# EAGLE design uc-com (EAGLE 9.6.2)
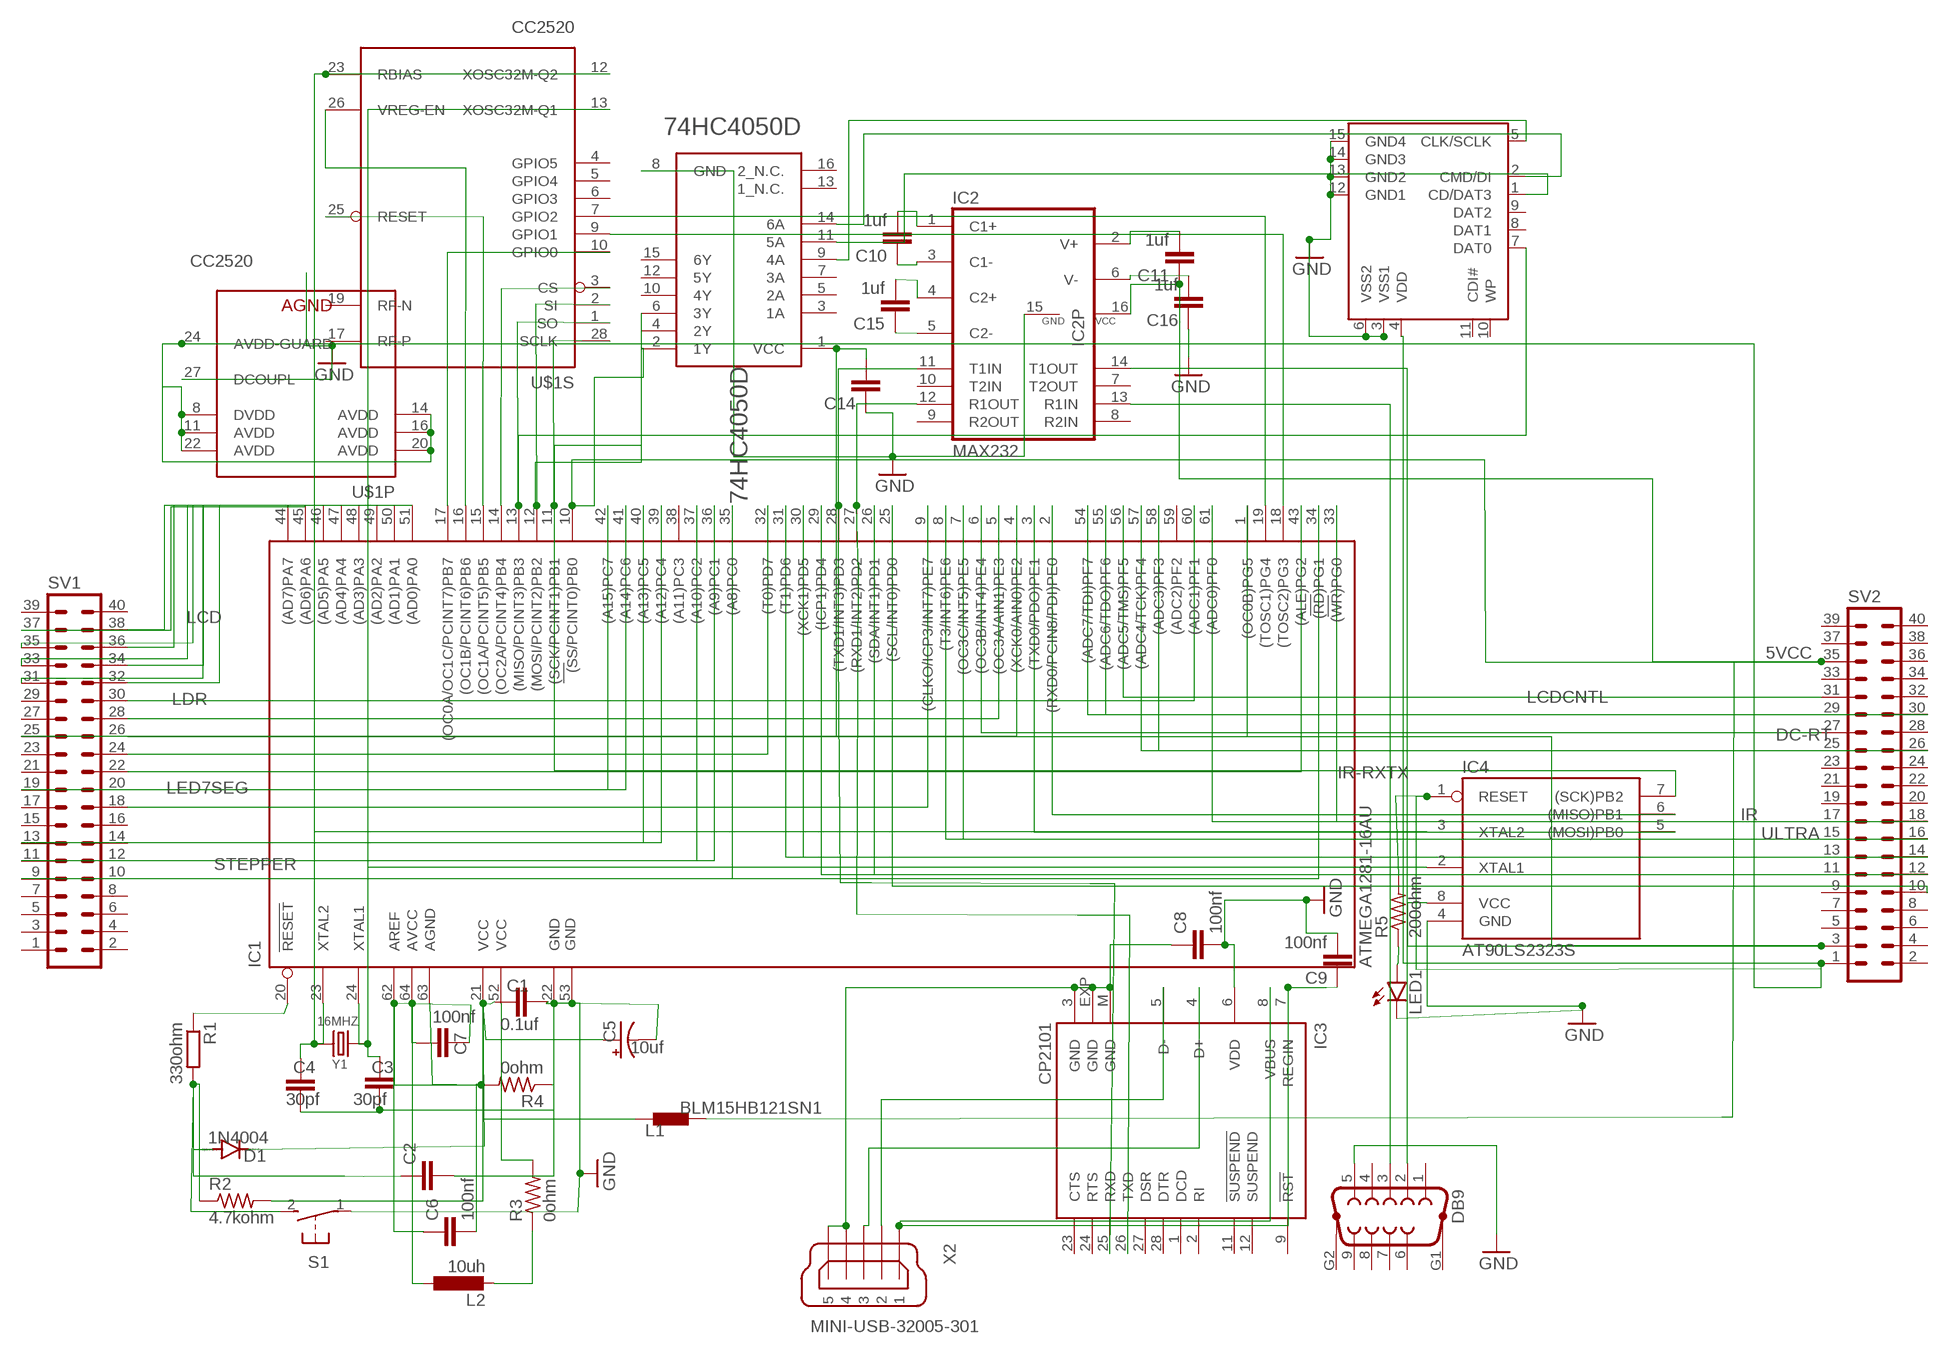
[diagram p0: schematic, sheet 1]

## Parts
74HC4050D  NXP_74HC4050DNXP_74HC4050D_0_0  [NXP_74HC4050D_0]
C1  0.1uf  C-EUC0201  [C0201]
C2  C-EUC0402  [C0402]
C3  30pf  C-EUC0201  [C0201]
C4  30pf  C-EUC0201  [C0201]
C5  10uf  CPOL-US085CS-1AR  [085CS_1AR]
C6  100nf  C-EUC0402K  [C0402K]
C7  100nf  C-EUC0402K  [C0402K]
C8  100nf  C-EUC0402K  [C0402K]
C9  100nf  C-EUC0402K  [C0402K]
C10  1uf  C-EUC0402K  [C0402K]
C11  1uf  C-EUC0402K  [C0402K]
C14  C-EUC0402K  [C0402K]
C15  1uf  C-EUC0402K  [C0402K]
C16  1uf  C-EUC0402K  [C0402K]
D1  1N4004  [DO41-10]
DB9  F09HP-7.2  [F09HP-7.2]
IC1  ATMEGA1281-16AU  [TQFP64]
IC2  MAX232  [DIL16]
IC3  CP2101  [MLP28]
IC4  AT90LS2323S  [SO08]
L1  BLM15HB121SN1  [0402]
L2  10uh  L-EU0204/7  [0204/7]
LED1  LED5MM  [LED5MM]
R1  330ohm  R-EU_R0603  [R0603]
R2  4.7kohm  R-US_M0805  [M0805]
R3  0ohm  R-US_M0805  [M0805]
R4  0ohm  R-US_M0805  [M0805]
R5  200ohm  R-US_M0805  [M0805]
S1  31-XX  [B3F-31XX]
SDCARD  SDCARDVAR2  [SDCMF-10915W010]
SV1  40P  [40P]
SV2  40P  [40P]
U$1  CC2520  [QFN50P500X500X100-29N]
X2  MINI-USB-32005-301  [32005-301]
Y1  16MHZ  DIP-CRYSTAL-16MHZ-18PF-30PPM-40R(HC49US)  [HC49US]

## Nets
5VCC: 74HC4050D.2(1Y) C11.1 IC1.10((SS/PCINT0)PB0) IC2.16(VCC) L1.1 SV2.35
7SEG: IC1.41((A14)PC6) SV1.19
DC-RT: IC1.6((OC3B/INT4)PE4) SV2.27
DH: IC1.32((T0)PD7) SV1.24
GND: 74HC4050D.8(GND) C1.2 C2.2 C3.2 C4.2 C5.- C8.2 C9.2 C14.1 C16.1 DB9.5 IC1.22(GND) IC1.53(GND1) IC2.15(GND) IC3.6(VDD) IC4.4(GND) LED1.K(C) R4.1 S1.1(P) SDCARD.3(VSS1) SDCARD.6(VSS2) SDCARD.12(GND1) SDCARD.13(GND2) SDCARD.14(GND3) SDCARD.15(GND4) U$1.27(P:DCOUPL) U$1.29(P:AGND)
IR: IC1.61((ADC0)PF0) SV2.17
IR-RXTX: IC1.33((WR)PG0) SV2.18
LCD: IC1.45((AD6)PA6) SV1.37
LCDCNTL: IC1.56((ADC5/TMS)PF5) SV2.31
LDR: IC1.60((ADC1)PF1) SV1.30
LED7SEG: IC1.43((ALE)PG2) SV1.22
N$1: C2.1 D1.A R1.2 R2.1 S1.2(S)
N$2: IC1.20(RESET) R1.1
N$3: C1.1 C5.+ D1.C IC1.21(VCC) L1.2 R2.2
N$4: 74HC4050D.1(VCC) C14.2 IC4.8(VCC) SV2.3
N$5: C4.1 IC1.23(XTAL2) IC4.3(XTAL2) U$1.12(S:XOSC32M-Q2) U$1.23(S:RBIAS) Y1.2
N$6: C7.2 IC1.64(AVCC) L2.1
N$7: C3.1 IC1.24(XTAL1) IC4.2(XTAL1) U$1.13(S:XOSC32M-Q1) Y1.1
N$8: C6.1 C6.2 C7.1 IC1.62(AREF) IC1.63(AGND) R4.2
N$9: IC1.27((RXD1/INT2)PD2) IC2.12(R1OUT) IC3.26(TXD)
N$10: L2.2 R3.1
N$11: IC1.52(VCC1) R3.2
N$12: IC1.28((TXD1/INT3)PD3) IC2.11(T1IN) IC3.25(RXD)
N$13: IC1.44((AD7)PA7) SV1.38
N$14: IC4.1(RESET) R5.2 SDCARD.4(VDD) SV2.1 U$1.8(P:DVDD) U$1.11(P:AVDD) U$1.14(P:AVDD) U$1.16(P:AVDD) U$1.20(P:AVDD) U$1.22(P:AVDD) U$1.24(P:AVDD-GUARD)
N$15: IC1.46((AD5)PA5) SV1.36
N$16: IC1.47((AD4)PA4) SV1.35
N$17: IC1.48((AD3)PA3) SV1.34
N$18: IC1.49((AD2)PA2) SV1.33
N$19: IC1.50((AD1)PA1) SV1.32
N$20: IC1.51((AD0)PA0) SV1.31
N$21: IC1.15((OC1A/PCINT5)PB5) U$1.25(S:RESET)
N$22: IC1.16((OC1B/PCINT6)PB6) U$1.26(S:VREG-EN)
N$23: 74HC4050D.6(3Y) IC1.12((MOSI/PCINT2)PB2) U$1.2(S:SI)
N$24: IC1.13((MISO/PCINT3)PB3) SDCARD.7(DAT0) U$1.1(S:SO)
N$25: 74HC4050D.4(2Y) IC1.11((SCK/PCINT1)PB1) IC4.7((SCK)PB2) U$1.28(S:SCLK)
N$26: IC1.14((OC2A/PCINT4)PB4) U$1.3(S:CS)
N$27: IC1.17((OC0A/OC1C/PCINT7)PB7) U$1.10(S:GPIO0)
N$28: IC1.18((TOSC2)PG3) U$1.9(S:GPIO1)
N$29: IC1.19((TOSC1)PG4) U$1.7(S:GPIO2)
N$30: IC3.5(D-) X2.2
N$31: IC3.4(D+) X2.3
N$32: C9.1 IC3.7(REGIN) IC3.8(VBUS) X2.1
N$33: C8.1 IC3.3(GND) IC3.EXP(GND) IC3.M(GND) X2.4 X2.5
N$34: DB9.3 IC2.13(R1IN)
N$35: DB9.2 IC2.14(T1OUT)
N$36: C15.1 IC2.5(C2-)
N$37: C15.2 IC2.4(C2+)
N$38: C11.2 IC2.2(V+)
N$39: C10.1 IC2.3(C1-)
N$40: C16.2 IC2.6(V-)
N$41: C10.2 IC2.1(C1+)
N$42: 74HC4050D.14(6A) SDCARD.2(CMD/DI)
N$43: IC1.54((ADC7/TDI)PF7) SV2.29
N$44: 74HC4050D.9(4A) SDCARD.5(CLK/SCLK)
N$45: 74HC4050D.11(5A) SDCARD.1(CD/DAT3)
N$47: IC1.55((ADC6/TDO)PF6) SV2.30
N$48: LED1.A R5.1
N$49: IC1.42((A15)PC7) SV1.20
N$50: IC1.58((ADC3)PF3) SV2.25
N$51: IC1.57((ADC4/TCK)PF4) SV2.26
N$52: IC1.1((OC0B)PG5) SV1.26
N$53: IC1.4((XCK0/AIN0)PE2) SV1.25
N$54: IC1.5((OC3A/AIN1)PE3) SV1.28
N$55: IC1.7((OC3C/INT5)PE5) SV2.15
N$56: IC1.25((SCL/INT0)PD0) SV2.10
N$57: IC1.26((SDA/INT1)PD1) SV2.11
N$58: IC1.29((ICP1)PD4) SV2.12
N$59: IC1.30((XCK1)PD5) SV2.13
N$60: IC1.31((T1)PD6) SV2.14
N$61: IC1.35((A8)PC0) SV1.10
N$62: IC1.39((A12)PC4) SV1.14
N$63: IC1.36((A9)PC1) SV1.12
N$64: IC1.37((A10)PC2) SV1.11
N$65: IC1.40((A13)PC5) SV1.13
N$66: IC1.9((CLKO/ICP3/INT7)PE7) SV1.18
N$67: IC1.2((RXD0/PCIN8/PDI)PE0) IC4.6((MISO)PB1)
N$68: IC1.3((TXD0/PDO)PE1) IC4.5((MOSI)PB0)
STEPPER: IC1.34((RD)PG1) SV1.9
ULTRA: IC1.8((T3/INT6)PE6) SV2.16
Unconnected: 74HC4050D.3(1A) 74HC4050D.5(2A) 74HC4050D.7(3A) 74HC4050D.10(4Y) 74HC4050D.12(5Y) 74HC4050D.13(1_N.C.) 74HC4050D.15(6Y) 74HC4050D.16(2_N.C.) DB9.1 DB9.4 DB9.6 DB9.7 DB9.8 DB9.9 DB9.G1 DB9.G2 IC1.38((A11)PC3) IC1.59((ADC2)PF2) IC2.7(T2OUT) IC2.8(R2IN) IC2.9(R2OUT) IC2.10(T2IN) IC3.1(DCD) IC3.2(RI) IC3.9(!RST) IC3.11(!SUSPEND) IC3.12(SUSPEND) IC3.23(CTS) IC3.24(RTS) IC3.27(DSR) IC3.28(DTR) SDCARD.8(DAT1) SDCARD.9(DAT2) SDCARD.10(WP) SDCARD.11(CDI#) SV1.1 SV1.2 SV1.3 SV1.4 SV1.5 SV1.6 SV1.7 SV1.8 SV1.15 SV1.16 SV1.17 SV1.21 SV1.23 SV1.27 SV1.29 SV1.39 SV1.40 SV2.2 SV2.4 SV2.5 SV2.6 SV2.7 SV2.8 SV2.9 SV2.19 SV2.20 SV2.21 SV2.22 SV2.23 SV2.24 SV2.28 SV2.32 SV2.33 SV2.34 SV2.36 SV2.37 SV2.38 SV2.39 SV2.40 U$1.4(S:GPIO5) U$1.5(S:GPIO4) U$1.6(S:GPIO3) U$1.15(NC) U$1.17(S:RF-P) U$1.18(NC) U$1.19(S:RF-N) U$1.21(NC)

## Library data of the parts
74HC4050D = NXP - 74HC4050D:NXP_74HC4050D: Buffer, Non-Inverting 6 Element 1 Bit per Element Push-Pull Output; CENTROID_NOT_SPECIFIED: No; DATASHEET: http://www.nxp.com/documents/data_sheet/74HC4050.pdf; DIGIKEY_DESCRIPTION: IC Buffer, Non-Inverting 6 Element 1 Bit per Element Push-Pull Output 16-SO; DIGIKEY_PART_NUMBER: 568-8150-1-ND; LEAD_FREE: yes; LOGIC_TYPE: Buffer, Non-Inverting; MF: NXP; MFG_PACKAGE_IDENT: SOT109-1; MOUSER_PART_NUMBER: 771-74HC4050D-T; MPN: 74HC4050D; NUMBER_OF_ELEMENTS: 6; PACKAGE: SOIC-16; PREFIX: U; ROHS: yes; TEMPERATURE_RANGE_HIGH: +125°C; TEMPERATURE_RANGE_LOW: -40°C; VOLTAGE_-_SUPPLY: 2V ~ 6V
C1-C4 C6-C11 C14-C16 = rcl:C-EU: CAPACITOR, European symbol; SPICEPREFIX: C
C5 = rcl:CPOL-US: POLARIZED CAPACITOR, American symbol; SPICEPREFIX: C
D1 = diode:1N4004: DIODE general purpose rectifier, 1 A
DB9 = sub-d:F09HP: SUB-D
IC1 = atmel-2005:ATMEGA1281*: MICROCONTROLLER 128 Kbytes FLASH 4 Kbytes EEPROM 8 Kbytes SRAM 54 General Purpose I/O pins 6-channels 16-bit PWM 2 x Serial USARTs 8-channels 10-bit A/D
IC2 = maxim:MAX232: RS232 TRANSCEIVER; MF: MAXIM; MPN: MAX232ACPE+; OC_FARNELL: 9723773; OC_NEWARK: 68K4544
IC3 = silabs:CP210*: Single-Chip USB to UART Bridge Source: www.silabs.com .. CP2101.pdf / cp2102.pdf; MF: FARNELL; MPN: CP2102-GM; OC_FARNELL: 9282130; OC_NEWARK: 30K5635
IC4 = atmel-1:AT90*2323: MICROCONTROLLER 2 Kbytes FLASH 128 bytes SRAM 128 bytes EEPROM
L1 = inductors:BLM15H: EMIFIL (R) Chip Ferrite Bead for GHz Noise Source: http://www.murata.com/ Ferrite Bead BLM15H.pdf
L2 = rcl:L-EU: INDUCTOR, European symbol; SPICEPREFIX: L
LED1 = led:LED: LED OSRAM: - CHIPLED LG R971, LG N971, LY N971, LG Q971, LY Q971, LO R971, LY R971 LH N974, LH R974 LS Q976, LO Q976, LY Q976 LO Q996 - Hyper CHIPLED LW Q18S LB Q993, LB Q99A, LB R99A - SideLED LS A670, LO A670, LY A670, LG A670, LP A670 LB A673, LV A673, LT A673, LW A673 LH A674 LY A675 LS A676, LA A676, LO A676, LY A676, LW A676 LS A679, LY A679, LG A679 - Hyper Micro SIDELED® LS Y876, LA Y876, LO Y876, LY Y876 LT Y87S - SmartLED LW L88C, LW L88S LB L89C, LB L89S, LG L890 LS L89K, LO L89K, LY L89K LS L896, LA L896, LO L896, LY L896 - TOPLED LS T670, LO T670, LY T670, LG T670, LP T670 LSG T670, LSP T670, LSY T670, LOP T670, LYG T670 LG T671, LOG T671, LSG T671 LB T673, LV T673, LT T673, LW T673 LH T674 LS T676, LA T676, LO T676, LY T676, LB T676, LH T676, LSB T676, LW T676 LB T67C, LV T67C, LT T67C, LS T67K, LO T67K, LY T67K, LW E67C LS E67B, LA E67B, LO E67B, LY E67B, LB E67C, LV E67C, LT E67C LW T67C LS T679, LY T679, LG T679 LS T770, LO T770, LY T770, LG T770, LP T770 LB T773, LV T773, LT T773, LW T773 LH T774 LS E675, LA E675, LY E675, LS T675 LS T776, LA T776, LO T776, LY T776, LB T776 LHGB T686 LT T68C, LB T68C - Hyper Mini TOPLED® LB M676 - Mini TOPLED Santana® LG M470 LS M47K, LO M47K, LY M47K Source: http://www.osram.convergy.de LUXEON: - LUMILED® LXK2-PW12-R00, LXK2-PW12-S00, LXK2-PW14-U00, LXK2-PW14-V00 LXK2-PM12-R00, LXK2-PM12-S00, LXK2-PM14-U00 LXK2-PE12-Q00, LXK2-PE12-R00, LXK2-PE12-S00, LXK2-PE14-T00, LXK2-PE14-U00 LXK2-PB12-K00, LXK2-PB12-L00, LXK2-PB12-M00, LXK2-PB14-N00, LXK2-PB14-P00, LXK2-PB14-Q00 LXK2-PR12-L00, LXK2-PR12-M00, LXK2-PR14-Q00, LXK2-PR14-R00 LXK2-PD12-Q00, LXK2-PD12-R00, LXK2-PD12-S00 LXK2-PH12-R00, LXK2-PH12-S00 LXK2-PL12-P00, LXK2-PL12-Q00, LXK2-PL12-R00 Source: www.luxeon.com KINGBRIGHT: KA-3528ASYC Source: www.kingbright.com
R1 = rcl:R-EU_: RESISTOR, European symbol; SPICEPREFIX: R
R2-R5 = rcl:R-US_: RESISTOR, American symbol; SPICEPREFIX: R
S1 = switch-omron:31-XX: OMRON SWITCH; MPN: B3F-3100; OC_FARNELL: 959704; OC_NEWARK: 36M3582
SDCARD = kingfont_sdcmf10915w010_covek:SDCARD: SD card connector KINGFONT SDCMF-10915W010
SV1 SV2 = con-dil:40P: DIL CABLE CONNECTOR
U$1 = chipcon-ti-v2:CC2520: 2.4 GHZ IEEE 802.15.4/ZIGBEE® RF TRANSCEIVER
X2 = con-cypressindustries:MINI-USB-: MINI USB-B Conector Source: www.cypressindustries.com; OC_FARNELL: unknown; OC_NEWARK: unknown
Y1 = OPL_Crystal Oscillator:DIP-CRYSTAL-16MHZ-18PF-30PPM-40R(HC49US): 306010014; MPN: HC-49US 16.000MHz

## Board
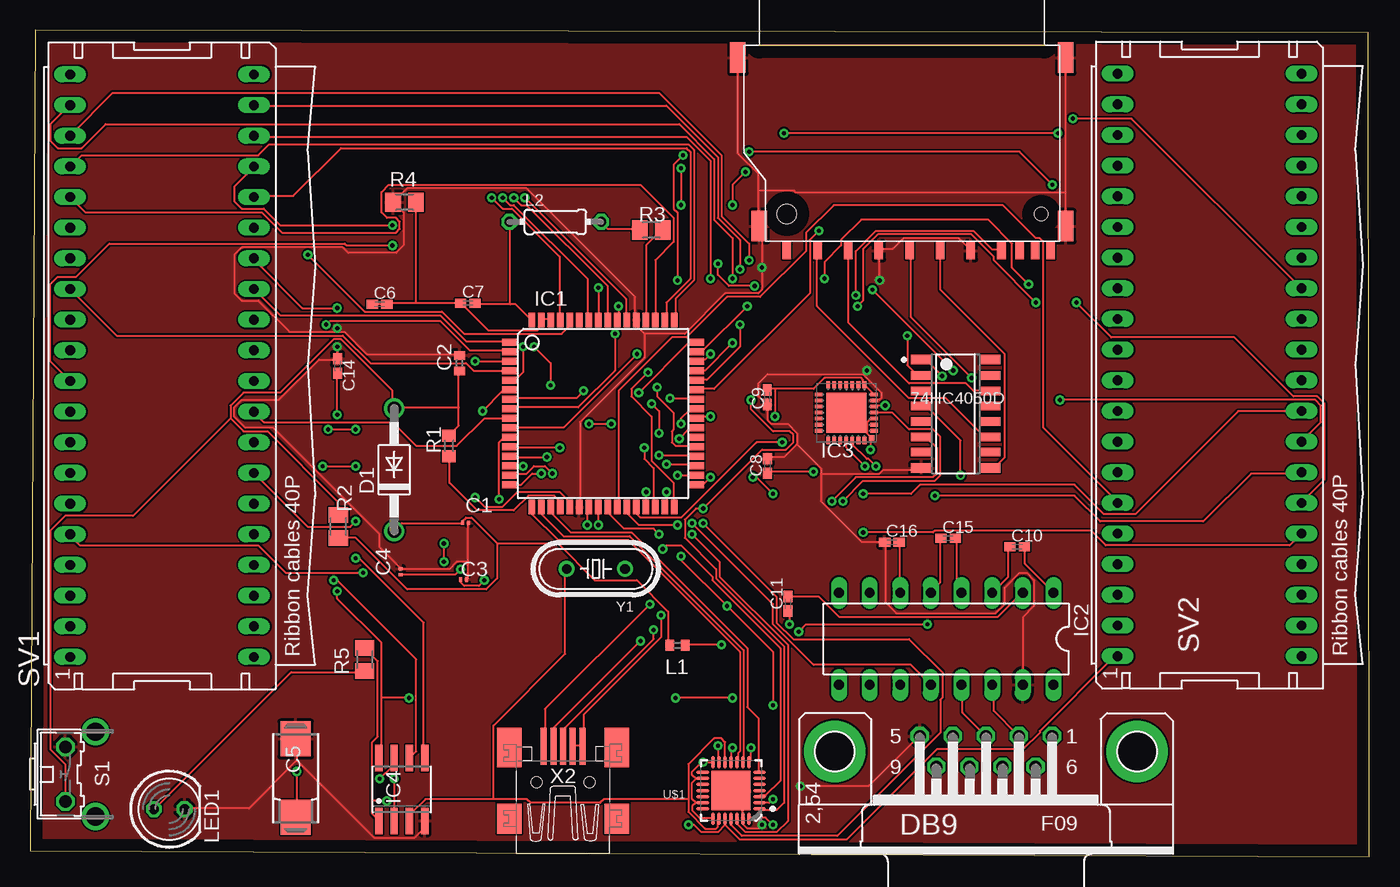
[diagram p1: board, top side]
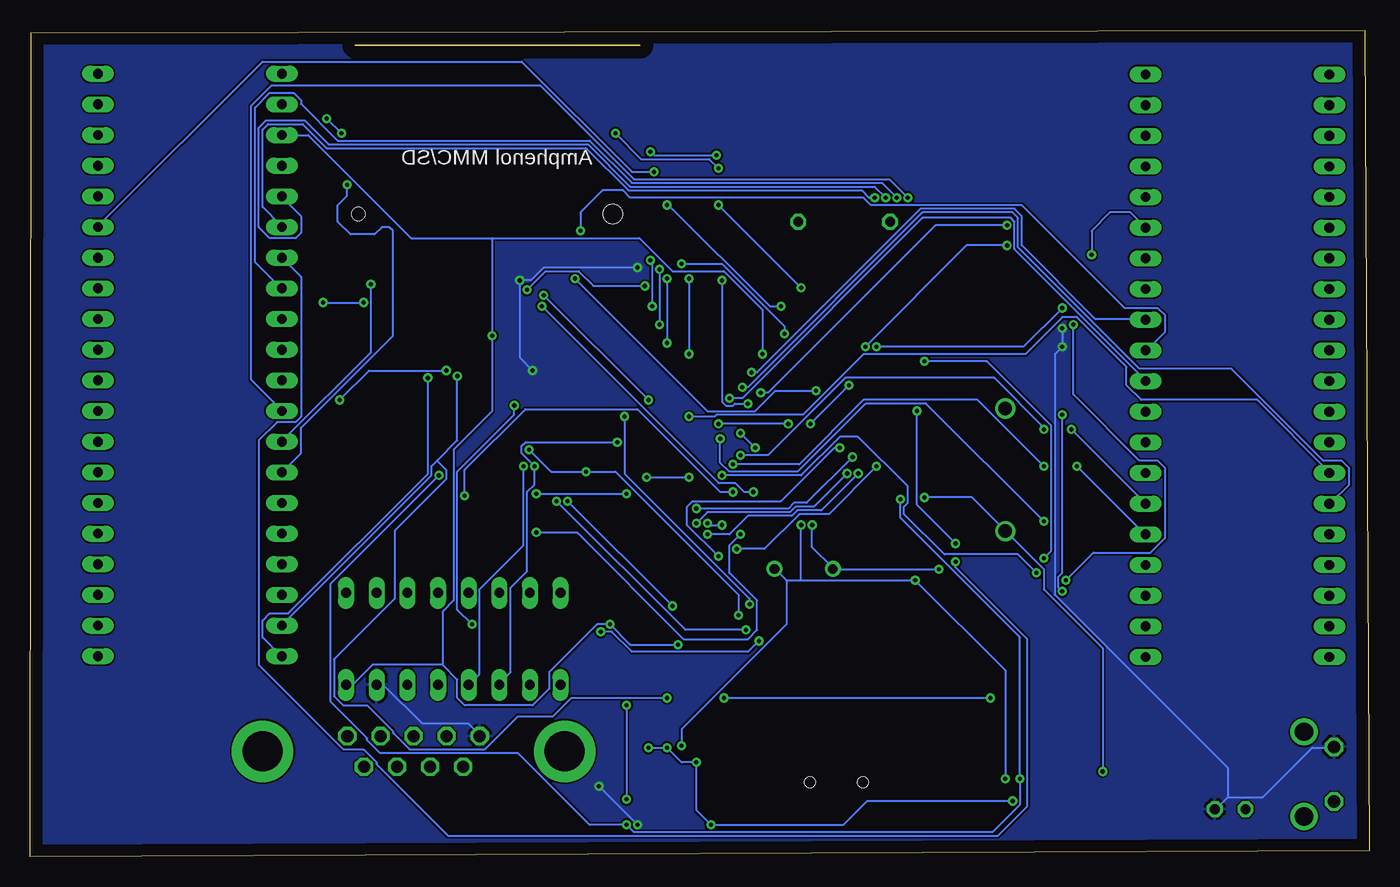
[diagram p2: board, bottom side, seen from below]

Size 111 x 68.48 mm. Coordinates in mm from the lower left corner, seen from the top.
Outline: 0,0.5 111,0 110.9,68.28 0.4,68.48 0,0.5
Copper layers (1*16): Top 0.035mm / dielectric 1.5mm / Bottom 0.035mm
Design rules "default": minimum track width 6mil, minimum drill 0.35mm, track to track 6mil, track to pad 6mil, pad to pad 6mil, via to via 6mil, smd to smd 6mil, copper to edge 40mil, drill to drill 6mil, minimum pad ring 10mil, minimum via ring 8mil, stop-mask expansion 4mil, vias tented up to drill 0mil, thermal gap 10mil

### Footprints (pad centres in the part's own frame; a part is rotated, then mirrored left to right if it is on the bottom)
NXP_74HC4050D_0 = smd 1.75 x 0.8: 1 -2.825,4.495; 8 -2.825,-4.495; 9 2.825,-4.495; 16 2.825,4.495 | smd 1.75 x 0.7: 2 -2.825,3.175; 3 -2.825,1.905; 4 -2.825,0.635; 5 -2.825,-0.635; 6 -2.825,-1.905; 7 -2.825,-3.175; 10 2.825,-3.175; 11 2.825,-1.905; 12 2.825,-0.635; 13 2.825,0.635; 14 2.825,1.905; 15 2.825,3.175
C0201 = smd 0.25 x 0.35: 1 -0.25,0; 2 0.25,0
C0402 = smd 0.7 x 0.9: 1 -0.65,0; 2 0.65,0
085CS_1AR = smd 2.9 x 2.5: + 3.25,0; - -3.25,0
C0402K = smd 0.925 x 0.74: 1 -0.6,0; 2 0.6,0
DO41-10 = drill 1.118: A 5.08,0; C -5.08,0
F09HP-7.2 = drill 1 octagon: 1 -5.486,-2.54; 2 -2.743,-2.54; 3 0,-2.54; 4 2.743,-2.54; 5 5.486,-2.54; 6 -4.115,0; 7 -1.372,0; 8 1.372,0; 9 4.115,0 | drill 3.3 pad 5.08: G1 -12.522,-1.27; G2 12.522,-1.27
TQFP64 = smd 1.194 x 0.559: 1 -7.76,5.905; 2 -7.76,5.118; 3 -7.76,4.331; 4 -7.76,3.543; 5 -7.76,2.756; 6 -7.76,1.968; 7 -7.76,1.181; 8 -7.76,0.394; 9 -7.76,-0.394; 10 -7.76,-1.181; 11 -7.76,-1.968; 12 -7.76,-2.756; 13 -7.76,-3.543; 14 -7.76,-4.331; 15 -7.76,-5.118; 16 -7.76,-5.905; 33 7.76,-5.905; 34 7.76,-5.118; 35 7.76,-4.331; 36 7.76,-3.543; 37 7.76,-2.756; 38 7.76,-1.968; 39 7.76,-1.181; 40 7.76,-0.394; 41 7.76,0.394; 42 7.76,1.181; 43 7.76,1.968; 44 7.76,2.756; 45 7.76,3.543; 46 7.76,4.331; 47 7.76,5.118; 48 7.76,5.905 | smd 0.559 x 1.194: 17 -5.905,-7.76; 18 -5.118,-7.76; 19 -4.331,-7.76; 20 -3.543,-7.76; 21 -2.756,-7.76; 22 -1.968,-7.76; 23 -1.181,-7.76; 24 -0.394,-7.76; 25 0.394,-7.76; 26 1.181,-7.76; 27 1.968,-7.76; 28 2.756,-7.76; 29 3.543,-7.76; 30 4.331,-7.76; 31 5.118,-7.76; 32 5.905,-7.76; 49 5.905,7.76; 50 5.118,7.76; 51 4.331,7.76; 52 3.543,7.76; 53 2.756,7.76; 54 1.968,7.76; 55 1.181,7.76; 56 0.394,7.76; 57 -0.394,7.76; 58 -1.181,7.76; 59 -1.968,7.76; 60 -2.756,7.76; 61 -3.543,7.76; 62 -4.331,7.76; 63 -5.118,7.76; 64 -5.905,7.76
DIL16 = drill 0.813 long: 1 -8.89,-3.81; 2 -6.35,-3.81; 3 -3.81,-3.81; 4 -1.27,-3.81; 5 1.27,-3.81; 6 3.81,-3.81; 7 6.35,-3.81; 8 8.89,-3.81; 9 8.89,3.81; 10 6.35,3.81; 11 3.81,3.81; 12 1.27,3.81; 13 -1.27,3.81; 14 -3.81,3.81; 15 -6.35,3.81; 16 -8.89,3.81
MLP28 = smd 0.6 x 0.3: 1 -2.3,1.5; 2 -2.3,1; 3 -2.3,0.5; 4 -2.3,0; 5 -2.3,-0.5; 6 -2.3,-1; 7 -2.3,-1.5; 15 2.3,-1.5; 16 2.3,-1; 17 2.3,-0.5; 18 2.3,0; 19 2.3,0.5; 20 2.3,1; 21 2.3,1.5 | smd 0.3 x 0.6: 8 -1.5,-2.3; 9 -1,-2.3; 10 -0.5,-2.3; 11 0,-2.3; 12 0.5,-2.3; 13 1,-2.3; 14 1.5,-2.3; 22 1.5,2.3; 23 1,2.3; 24 0.5,2.3; 25 0,2.3; 26 -0.5,2.3; 27 -1,2.3; 28 -1.5,2.3 | smd 3.3 x 3.3: EXP 0,0 | smd 0.435 x 0.435: M -2.103,2.103
SO08 = smd 0.6 x 2.2: 1 -1.905,-2.6; 2 -0.635,-2.6; 3 0.635,-2.6; 4 1.905,-2.6; 5 1.905,2.6; 6 0.635,2.6; 7 -0.635,2.6; 8 -1.905,2.6
0402 = smd 0.7 x 0.9: 1 -0.65,0; 2 0.65,0
0204/7 = drill 0.813 octagon: 1 -3.81,0; 2 3.81,0
LED5MM = drill 0.813 octagon: A -1.27,0; K 1.27,0
R0603 = smd 1 x 1.1: 1 -0.85,0; 2 0.85,0
M0805 = smd 1.3 x 1.6: 1 -0.95,0; 2 0.95,0
B3F-31XX = drill 1.016 octagon: 1 -2.261,-1.245; 2 2.261,-1.245 | drill 1.499 pad 2.159: 3 -3.505,1.245; 4 3.505,1.245
SDCMF-10915W010 = smd 0.711 x 1.422: 1 7.366,13.462; 2 4.826,13.462; 3 2.286,13.462; 4 -0.254,13.462; 5 -2.794,13.462; 6 -5.334,13.462; 7 -7.874,13.462; 8 -9.398,13.462; 9 9.906,13.462; 10 -11.938,13.462; 11 -10.668,13.462 | smd 1.27 x 2.54: 12 12.192,11.43; 13 13.97,-2.54; 14 -13.208,-2.54; 15 -13.208,11.43 | hole 1.6: 9.906,10.414 | hole 1.1: -11.176,10.414
40P = drill 0.813 long: 1 -24.13,7.62; 2 -24.13,-7.62; 3 -21.59,7.62; 4 -21.59,-7.62; 5 -19.05,7.62; 6 -19.05,-7.62; 7 -16.51,7.62; 8 -16.51,-7.62; 9 -13.97,7.62; 10 -13.97,-7.62; 11 -11.43,7.62; 12 -11.43,-7.62; 13 -8.89,7.62; 14 -8.89,-7.62; 15 -6.35,7.62; 16 -6.35,-7.62; 17 -3.81,7.62; 18 -3.81,-7.62; 19 -1.27,7.62; 20 -1.27,-7.62; 21 1.27,7.62; 22 1.27,-7.62; 23 3.81,7.62; 24 3.81,-7.62; 25 6.35,7.62; 26 6.35,-7.62; 27 8.89,7.62; 28 8.89,-7.62; 29 11.43,7.62; 30 11.43,-7.62; 31 13.97,7.62; 32 13.97,-7.62; 33 16.51,7.62; 34 16.51,-7.62; 35 19.05,7.62; 36 19.05,-7.62; 37 21.59,7.62; 38 21.59,-7.62; 39 24.13,7.62; 40 24.13,-7.62
QFN50P500X500X100-29N = smd 1.05 x 0.3: 1 -2.35,1.5; 2 -2.35,1; 3 -2.35,0.5; 4 -2.35,0; 5 -2.35,-0.5; 6 -2.35,-1; 7 -2.35,-1.5; 15 2.35,-1.5; 16 2.35,-1; 17 2.35,-0.5; 18 2.35,0; 19 2.35,0.5; 20 2.35,1; 21 2.35,1.5 | smd 0.3 x 1.05: 8 -1.5,-2.35; 9 -1,-2.35; 10 -0.5,-2.35; 11 0,-2.35; 12 0.5,-2.35; 13 1,-2.35; 14 1.5,-2.35; 22 1.5,2.35; 23 1,2.35; 24 0.5,2.35; 25 0,2.35; 26 -0.5,2.35; 27 -1,2.35; 28 -1.5,2.35 | smd 3.25 x 3.25: 29 0,0
32005-301 = smd 3.1 x 0.5: 1 3,1.6; 2 3,0.8; 3 3,0; 4 3,-0.8; 5 3,-1.6 | smd 2.5 x 2: M1 -3,-4.45; M2 -3,4.45 | smd 3.3 x 2: M3 2.9,4.45; M4 2.9,-4.45 | hole 0.9: 0,2.2; 0,-2.2
HC49US = drill 0.813: 1 -2.413,0; 2 2.413,0

### Placement (x,y rotation side)
74HC4050D  76.71,36.69 0 top
C1  36.1,27.67 0 top
C2  35.58,40.89 90 top
C3  35.92,22.97 0 top
C4  30.71,23.62 90 top
C5  22.01,6.5 270 top
C6  28.96,45.77 0 top
C7  36.28,45.87 0 top
C8  61.11,32.38 90 top
C9  61.09,38.06 270 top
C10  81.81,25.67 0 top
C11  62.81,20.96 90 top
C14  25.47,40.66 270 top
C15  76.1,26.37 0 top
C16  71.42,26.06 0 top
D1  30.17,32.05 90 top
DB9  79.22,7.45 180 top
IC1  47.48,36.72 0 top
IC2  75.93,18.05 180 top
IC3  67.65,36.79 180 top
IC4  30.8,5.57 0 top
L1  53.65,17.51 180 top
L2  43.53,52.6 0 top
LED1  11.53,3.94 0 top
R1  34.71,34.03 90 top
R2  25.54,27.36 270 top
R3  51.48,51.92 0 top
R4  31.03,54.22 0 top
R5  27.72,16.33 90 top
S1  4.17,6.83 270 top
SDCARD  72.63,63.67 180 top
SV1  10.93,40.68 90 top
SV2  97.76,40.74 90 top
U$1  58.1,5.48 180 top
X2  44.17,6.15 90 top
Y1  46.89,23.84 180 top

### Tracks (layer width: path | path; a pad name or v marks a point on that pad's centre or on a via)
5VCC  (via drill 0.35)
  Top 0.152: v57.31,17.57 54.41,17.57 L1.1 | v62.95,19.24 62.95,20.31 C11.1 | v50.3,41.65 44.2,35.55 39.78,35.55 IC1.10 | v72.7,43.17 72.7,40.73 73.46,39.97 73.77,39.97 74HC4050D.2
  Bottom 0.152: v57.31,17.57 61.27,17.57 v62.95,19.24 64.01,19.24 67.98,15.28 67.98,13.91 69.35,12.54 74.99,12.54 75.59,13.15 75.59,14.67 76.81,15.89 | 76.81,15.89 82.61,15.89 84.13,14.37 84.74,14.37 IC2.16 | v50.3,41.65 50.3,45.31 53.5,48.51 57.76,48.51 60.51,51.25 72.7,51.25 | 72.7,51.25 79.41,51.25 87.94,59.78 90.07,59.78 SV2.35 | 72.7,51.25 v72.7,43.17 72.7,36.92 75.9,33.72 75.9,21.23 76.81,20.31 76.81,15.89
7SEG  (via drill 0.35)
  Top 0.152: v53.95,35.86 53.95,36.31 54.72,37.08 55.17,37.08 IC1.41 | v46.33,35.86 v48.16,35.86 | v43.13,39.06 43.13,40.89 v41.76,42.26 | v30.03,50.64 26.22,50.64 26.06,50.79 6.56,50.79 3.82,48.05 2.29,48.05 1.68,47.44 1.68,41.04 3.21,39.51 SV1.19
  Bottom 0.152: v48.16,35.86 v53.95,35.86 | v43.13,39.06 v46.33,35.86 | v41.76,42.26 33.38,50.64 v30.03,50.64
DC-RT  (via drill 0.35)
  Top 0.152: v37.5,36.92 39.17,38.6 39.63,38.6 IC1.6 | v34.3,24.43 v34.3,25.95
  Bottom 0.152: v37.5,36.92 37.5,29.15 v34.3,25.95 | v34.3,24.43 34.3,23.97 28.35,18.03 28.35,4.16 30.79,1.72 76.36,1.72 82.3,7.66 82.3,7.82 83.37,8.88 85.04,8.88 92.05,15.89 92.05,34.48 90.53,36.01 89.01,36.01 88.55,36.47 88.55,48.05 90.07,49.57 SV2.27
DH  (via drill 0.35)
  Top 0.152: v51.21,40.12 49.84,38.75 49.84,38.14 51.52,36.47 51.52,32.81 53.35,30.98 53.35,29 IC1.32
  Bottom 0.152: v51.21,40.12 50.75,40.12 37.19,53.69 29.42,53.69 28.81,53.08 28.81,50.64 22.71,44.54 18.6,44.54 SV1.24
GND  (via drill 0.35)
  Top 0.152: U$1.29 58.22,5.38 58.98,4.61 58.98,3.24 U$1.27 59.14,3.09 59.14,2.63 59.44,2.33 60.36,2.33 v60.66,2.63 | v63.86,5.83 69.5,5.83 73.61,9.95 DB9.5 | SDCARD.6 77.88,50.34 76.97,51.25 72.39,51.25 71.48,50.34 70.41,50.34 SDCARD.3 70.41,50.18 v70.41,47.74 | 69.04,39.97 70.57,38.45 70.57,37.99 70.41,37.84 69.96,37.84 IC3.6 | 69.04,39.97 61.12,39.97 60.36,39.21 60.36,38.14 60.97,37.53 C9.2 61.12,37.38 61.12,36.16 61.42,35.86 62.79,35.86 63.56,35.1 63.56,34.18 | 63.56,34.18 62.49,33.11 61.12,33.11 C8.2 | 65.54,31.74 65.54,32.2 63.56,34.18 | 65.54,31.74 65.54,29.46 68.89,26.1 70.72,26.1 C16.1 70.87,25.95 70.87,21.07 71.78,20.16 80.02,20.16 80.78,20.92 80.78,22.29 82,23.51 82.61,23.51 83.22,22.9 83.22,20.77 82.3,19.86 82.3,14.37 IC2.15 | 65.54,31.74 70.41,31.74 70.72,32.05 73.77,32.05 74HC4050D.8 | 69.04,39.97 v69.35,40.28 | 22.1,7.97 28.5,1.57 31.86,1.57 32.62,2.33 32.62,2.94 IC4.4 | 22.1,7.97 22.1,9.64 C5.- | 22.1,7.97 18.14,4 12.81,4 LED1.K | 36.28,24.43 36.28,27.63 C1.2 | 36.28,24.43 36.28,23.05 C3.2 | 36.28,24.43 35.36,24.43 34.75,23.82 30.79,23.82 C4.2 30.64,23.97 28.96,25.65 28.96,26.71 20.12,35.55 17.84,35.55 16.92,36.47 16.92,37.23 17.53,37.84 20.58,37.84 23.93,41.19 25.46,41.19 C14.1 25.46,41.34 v25.46,42.26 | 25.46,43.48 21.49,43.48 18.9,46.07 17.53,46.07 16.92,46.68 16.92,49.88 17.53,50.49 25.91,50.49 26.37,50.03 30.33,50.03 30.94,50.64 30.94,53.38 30.18,54.15 R4.1 30.18,54.3 31.25,55.36 41.15,55.36 50.14,46.37 50.14,44.54 IC1.53 50.3,44.39 50.3,43.93 50.91,43.32 | 25.46,43.48 26.06,43.48 27.89,41.65 35.51,41.65 C2.2 | 50.91,43.32 50.91,41.34 45.57,36.01 45.57,29 IC1.22
  Top 0.152: 85.81,55.06 85.81,66.18 SDCARD.14 | 85.81,55.06 85.81,52.32 SDCARD.15 | 60.36,55.21 60.36,52.32 SDCARD.12 60.51,52.16 60.66,52.01 v60.66,48.81 60.66,46.98 60.36,46.68 57.61,46.68 54.26,43.32 50.91,43.32 | 60.36,55.21 60.36,56.58 58.68,58.26 58.68,66.18 SDCARD.13 | 85.81,55.06 63.4,55.06 63.25,55.21 60.36,55.21 | 25.46,43.48 v25.46,43.78
  Bottom 0.152: IC2.15 82.15,14.22 81.69,14.22 78.49,11.02 74.68,11.02 73.77,10.1 DB9.5 | v63.86,5.83 v60.66,2.63 | v69.35,40.28 70.41,41.34 v70.41,47.74 69.5,47.74 68.43,48.81 v60.66,48.81 | 11.74,4.92 8.84,4.92 4.73,9.03 3.05,9.03 S1.1 | 11.74,4.92 12.65,4 LED1.K | v25.46,43.78 v25.46,42.26 26.06,41.65 26.06,21.68 11.74,7.36 11.74,4.92
  pour Top: -0.9,69.68 111.9,69.68 111.9,-1.02 -1.1,-1.02 -1.1,2.18 -1.1,69.68
  pour Bottom: -1.8,70.58 113,70.58 113,-2.22 -2,-2.22 -2,-1.22 -2,70.58
IR  (via drill 0.35)
  Top 0.152: v38.26,54.6 39.17,53.69 39.93,53.69 43.9,49.73 43.9,44.54 IC1.61
  Bottom 0.152: v38.26,54.6 39.78,56.13 60.97,56.13 68.74,63.9 90.99,63.9 92.66,62.22 92.66,39.51 90.23,37.08 SV2.17
IR-RXTX  (via drill 0.35)
  Top 0.152: v56.39,31.44 55.78,30.83 55.33,30.83 IC1.33 | v59.9,31.44 60.2,31.44 v61.57,30.07 | v69.04,30.07 73,30.07 73.77,30.83 86.57,30.83 89.01,28.39 91.6,28.39 100.13,36.92 105.31,36.92 SV2.18
  Bottom 0.152: v59.9,31.44 v56.39,31.44 | v69.04,30.07 v61.57,30.07
LCD  (via drill 0.35)
  Top 0.152: v58.22,42.56 55.94,40.28 55.33,40.28 IC1.45 | v58.22,47.9 58.22,51.25 56.7,52.77 56.7,57.8 53.8,60.7 6.25,60.7 4.27,58.72 2.29,58.72 1.68,59.33 1.68,60.7 3.21,62.22 SV1.37
  Bottom 0.152: v58.22,47.9 v58.22,42.56
LCDCNTL  (via drill 0.35)
  Top 0.152: v40.09,54.6 40.7,53.99 41.15,53.99 47.86,47.29 47.86,44.54 IC1.56
  Bottom 0.152: v40.09,54.6 41,55.52 61.27,55.52 64.78,59.02 86.26,59.02 88.24,61 91.45,61 92.05,60.39 92.05,52.16 91.14,51.25 89.01,51.25 88.55,51.71 88.55,53.08 90.07,54.6 SV2.31
LDR  (via drill 0.35)
  Top 0.152: v23.02,49.88 27.74,45.15 34.14,45.15 35.97,43.32 44.05,43.32 44.66,43.93 44.66,44.39 IC1.60
  Bottom 0.152: v23.02,49.88 23.02,51.86 21.49,53.38 19.82,53.38 18.6,52.16 SV1.30
LED7SEG  (via drill 0.35)
  Top 0.152: v65.38,51.86 64.62,51.1 64.62,46.68 56.7,38.75 55.33,38.75 IC1.43
  Bottom 0.152: v65.38,51.86 65.38,53.38 63.56,55.21 61.88,55.21 61.27,54.6 41.92,54.6 41.3,53.99 28.81,53.99 20.27,45.46 17.53,45.46 16.92,44.85 16.92,43.48 18.45,41.95 SV1.22
N$1
  Top 0.152: 35.51,37.23 35.51,35.7 34.75,34.94 R1.2 | 35.51,37.23 35.51,40.12 C2.1 | 16.62,36.31 17.68,35.25 19.66,35.25 25.46,29.46 25.46,28.39 R2.1 | 16.62,36.31 16.62,37.38 17.68,38.45 20.73,38.45 25.15,42.87 25.76,42.87 30.03,38.6 30.03,37.23 D1.A 30.18,37.23 35.51,37.23 | 16.62,36.31 8.54,28.24 2.9,28.24 1.68,27.02 1.68,8.88 2.9,7.66 2.9,4.61 S1.2
N$2
  Top 0.152: R1.1 34.75,33.11 34.75,30.98 37.04,28.69 40.09,28.69 41.3,29.91 43.44,29.91 43.9,29.46 43.9,29 IC1.20
N$3  (via drill 0.35)
  Top 0.152: D1.C 30.18,27.02 30.79,27.63 35.82,27.63 C1.1 35.82,27.78 36.12,28.08 36.58,28.08 38.71,25.95 | 38.71,25.95 43.74,25.95 46.79,22.9 50.3,22.9 52.89,20.31 52.89,17.57 L1.2 | v36.89,29.76 37.65,29 39.17,29 40.39,30.22 43.9,30.22 44.66,29.46 44.66,29 IC1.21 | 38.71,25.95 38.71,23.05 37.8,22.14 31.25,22.14 26.98,26.41 25.61,26.41 R2.2 | v22.1,7.05 22.1,3.4 C5.+
  Bottom 0.152: v36.89,29.76 32.92,29.76 30.18,27.02 D1.C 30.03,26.86 26.98,23.82 26.98,22.14 22.1,17.26 v22.1,7.05
N$4  (via drill 0.35)
  Top 0.152: v25.46,36.62 25.46,39.97 C14.2 | v25.46,21.99 25.46,21.38 29.11,17.72 29.11,13.15 | 29.11,13.15 29.11,8.43 28.96,8.27 IC4.8 | v75.59,39.82 74.38,41.04 73.92,41.04 74HC4050D.1 | v31.4,13.15 29.11,13.15 | v58.22,13.15 v53.5,13.15
  Bottom 0.152: v25.46,36.62 25.46,23.51 25.76,23.21 25.76,22.29 v25.46,21.99 | v75.59,39.82 75.59,34.48 77.27,32.81 | 77.27,32.81 77.73,32.35 77.73,31.59 90.07,19.24 SV2.3 | v53.5,13.15 v31.4,13.15 | v58.22,13.15 66.15,13.15 67.67,11.62 70.57,11.62 73.31,8.88 79.56,8.88 80.93,10.25 80.93,10.41 83.06,12.54 85.04,12.54 85.81,13.3 85.81,16.35 80.78,21.38 80.78,27.02 76.51,31.29 76.51,32.05 77.27,32.81
N$5  (via drill 0.35)
  Top 0.152: v35.67,23.82 35.21,23.36 30.79,23.36 C4.1 | v46.18,27.47 46.18,28.85 IC1.23 | 54.56,4.77 54.56,7.66 56.7,9.8 57.31,9.8 57.61,9.49 57.61,7.97 U$1.12 | 54.56,4.77 54.56,3.7 55.94,2.33 56.85,2.33 57,2.48 57,3.09 U$1.23 | 38.41,4.77 41.15,4.77 41.46,4.46 47.25,4.46 47.55,4.77 54.56,4.77 | 38.41,4.77 32.77,4.77 31.55,3.55 31.55,3.09 IC4.3 | 38.41,4.77 38.41,10.86 44.35,16.81 44.35,23.82 Y1.2
  Bottom 0.152: v35.67,23.82 44.35,23.82 Y1.2 44.51,23.97 46.18,25.65 v46.18,27.47
N$6
  Top 0.152: 39.78,45.76 40.24,45.76 41.46,44.54 IC1.64 | 39.78,45.76 36.89,45.76 C7.2 | 39.78,45.76 39.78,52.47 L2.1
N$7  (via drill 0.35)
  Top 0.152: v37.65,22.9 37.19,22.45 35.97,22.45 35.67,22.75 35.67,22.9 C3.1 | v57,9.19 57,7.97 U$1.13 | v47.1,27.47 47.1,28.85 IC1.24 | v30.18,6.44 30.18,3.09 IC4.2
  Bottom 0.152: 48.32,22.9 47.1,22.9 | 47.1,22.9 v37.65,22.9 30.18,15.43 v30.18,6.44 | 48.32,22.9 49.23,23.82 Y1.1 | v57,9.19 57,10.56 48.32,19.24 48.32,22.9 | 47.1,22.9 v47.1,27.47
N$8
  Top 0.152: IC1.62 43.13,44.54 42.37,44.54 IC1.63 42.22,44.39 42.22,43.78 42.07,43.63 37.95,43.63 35.82,45.76 C7.1 35.67,45.91 32.01,45.91 | C6.1 28.5,45.76 29.42,45.76 C6.2 29.57,45.91 32.01,45.91 | 32.01,45.91 32.01,54.15 R4.2
N$9  (via drill 0.35)
  Top 0.152: v70.11,32.35 69.5,32.96 69.35,32.96 68.13,34.18 68.13,34.48 IC3.26 | v53.65,27.47 50.45,27.47 49.54,28.39 49.54,28.85 IC1.27 | v54.87,27.63 61.57,20.92 61.57,19.24 64.93,15.89 73,15.89 74.53,14.37 IC2.12
  Bottom 0.152: v70.11,32.35 70.11,25.8 73.77,22.14 73.77,15.13 74.53,14.37 IC2.12 | v53.65,27.47 54.72,27.47 v54.87,27.63
N$10
  Top 0.152: R3.1 50.45,52.01 47.86,52.01 47.4,52.47 L2.2
N$11
  Top 0.152: IC1.52 51.06,44.54 51.06,50.64 52.28,51.86 R3.2
N$12  (via drill 0.35)
  Top 0.152: v69.19,32.35 67.67,33.88 67.67,34.48 IC3.25 | v62.34,34.33 60.2,34.33 53.95,28.08 50.6,28.08 50.3,28.39 50.3,28.85 IC1.28
  Bottom 0.152: IC2.11 72.09,14.37 71.18,15.28 71.18,22.29 69.8,23.66 69.8,30.22 69.19,30.83 v69.19,32.35 70.26,33.42 70.26,34.03 69.96,34.33 v62.34,34.33
N$13  (via drill 0.35)
  Top 0.152: v58.83,44.09 58.83,42.26 56.09,39.51 55.33,39.51 IC1.44 | v58.83,48.66 58.83,51.1 57,52.93 57,57.96 52.73,62.22 18.6,62.22 SV1.38
  Bottom 0.152: v58.83,48.66 v58.83,44.09
N$14  (via drill 0.35)
  Top 0.152: 28.35,4.61 28.35,3.55 28.81,3.09 IC4.1 | 28.35,4.61 28.35,9.49 28.81,9.95 28.81,16.2 27.74,17.26 R5.2 | v58.22,9.03 58.07,8.88 58.07,7.97 U$1.11 | v59.75,9.03 59.75,7.97 U$1.8 | 55.17,4.46 54.87,4.16 54.87,3.85 55.48,3.24 56.55,3.24 U$1.22 | 55.17,4.46 55.63,4.46 U$1.20 | 55.17,6.44 55.63,6.44 U$1.16 | 55.17,6.44 54.87,6.14 54.87,4.77 55.17,4.46 | 55.17,6.44 54.87,6.75 54.87,7.05 55.63,7.82 v55.78,7.82 56.55,7.82 U$1.14 | 57.61,2.63 57.61,3.09 U$1.24 57.61,2.63 | 57.61,2.63 58.83,1.41 67.67,1.41 75.14,8.88 82.3,8.88 83.67,10.25 83.67,10.41 89.77,16.5 90.07,16.5 SV2.1 | v78.03,39.67 73,44.7 73,50.18 SDCARD.4 | v54.56,2.63 55.02,2.63 55.63,2.02 57,2.02 57.61,2.63 | v29.57,4.61 28.35,4.61
  Bottom 0.152: v59.75,9.03 v58.22,9.03 57,7.82 v55.78,7.82 55.78,3.85 v54.56,2.63 43.59,2.63 41.61,4.61 v29.57,4.61 | v78.03,39.67 78.03,31.74 89.62,20.16 91.14,20.16 91.75,19.55 91.75,18.18 90.23,16.65 SV2.1
N$15  (via drill 0.35)
  Top 0.152: v56.39,41.65 55.94,41.19 55.33,41.19 IC1.46 | v56.39,47.9 56.39,57.65 54.41,59.63 18.6,59.63 SV1.36
  Bottom 0.152: v56.39,47.9 v56.39,41.65
N$16  (via drill 0.35)
  Top 0.152: v59.44,45.61 55.78,41.95 55.33,41.95 IC1.47 | v59.59,49.42 59.59,50.79 57.31,53.08 57.31,58.11 52.13,63.29 6.86,63.29 3.36,59.78 SV1.35
  Bottom 0.152: v59.44,45.61 59.44,49.27 v59.59,49.42
N$17  (via drill 0.35)
  Top 0.152: v50.45,38.45 54.56,42.56 55.17,42.56 IC1.48 | v30.03,52.32 20.73,52.32 19.36,53.69 17.53,53.69 16.92,54.3 16.92,55.52 18.45,57.04 SV1.34
  Bottom 0.152: v50.45,38.45 49.84,38.45 35.97,52.32 v30.03,52.32
N$18
  Top 0.152: IC1.49 53.5,44.54 53.5,46.22 55.02,47.74 55.02,58.56 54.56,59.02 19.82,59.02 18.9,58.11 4.27,58.11 3.36,57.19 SV1.33
N$19
  Top 0.152: IC1.50 52.73,44.54 52.73,45.91 54.72,47.9 54.72,58.41 54.41,58.72 25.76,58.72 21.8,54.75 18.6,54.75 SV1.32
N$20
  Top 0.152: IC1.51 51.82,44.54 51.82,49.42 53.35,50.94 53.35,52.93 50.6,55.67 29.72,55.67 29.11,55.06 29.11,53.38 29.57,52.93 30.33,52.93 30.64,52.62 30.64,52.01 30.33,51.71 20.88,51.71 19.21,53.38 4.58,53.38 3.36,54.6 SV1.31
N$21  (via drill 0.35)
  Top 0.152: v55.78,27.63 61.88,21.53 61.88,19.4 63.25,18.03 72.85,18.03 75.59,15.28 75.59,13.15 75.44,13 75.44,10.25 66.91,1.72 58.98,1.72 58.07,2.63 58.07,3.09 U$1.25 | v43.29,31.74 42.68,32.35 41.76,32.35 41.15,31.74 39.78,31.74 IC1.15
  Bottom 0.152: v55.78,27.63 54.87,28.54 48.01,28.54 47.55,29 46.03,29 v43.29,31.74
N$22  (via drill 0.35)
  Top 0.152: v54.87,26.71 57.16,24.43 57.16,23.21 62.79,17.57 62.79,2.94 61.88,2.02 59.29,2.02 58.68,2.63 58.68,3.09 U$1.26 | v42.37,31.74 41.61,31.74 40.7,30.83 39.78,30.83 IC1.16
  Bottom 0.152: v54.87,26.71 53.04,26.71 51.52,28.24 47.86,28.24 47.4,28.69 45.42,28.69 v42.37,31.74
N$23  (via drill 0.35)
  Top 0.152: v61.57,4.77 61.27,4.46 60.51,4.46 U$1.2 | v61.57,12.54 61.57,16.96 v57.76,20.77 53.95,24.58 v53.95,24.88 | v66.45,29.46 68.43,31.44 74.83,31.44 75.14,31.74 75.14,33.88 74.38,34.64 73.92,34.64 74HC4050D.6 | v43.9,33.88 39.78,33.88 IC1.12
  Bottom 0.152: v61.57,12.54 v61.57,4.77 | v66.45,29.46 v57.76,20.77 | v43.9,33.88 44.35,33.88 48.77,29.46 56.09,29.46 56.55,29 56.55,27.47 v53.95,24.88
N$24  (via drill 0.35)
  Top 0.152: v42.83,33.11 39.78,33.11 IC1.13 | U$1.1 60.51,3.85 61.88,3.85 62.49,4.46 62.49,17.42 56.85,23.05 56.85,23.82 54.26,26.41 54.26,27.93 55.17,28.85 v55.78,28.85 60.66,33.72 62.64,33.72 63.25,34.33 63.25,34.94 62.95,35.25 61.57,35.25 59.75,37.08 v59.75,37.84 | v68.43,46.53 68.43,50.18 70.11,51.86 78.19,51.86 79.71,50.34 80.47,50.34 SDCARD.7
  Bottom 0.152: v55.78,28.85 48.16,28.85 47.71,29.3 46.64,29.3 v42.83,33.11 | v59.75,37.84 v68.43,46.53
N$25  (via drill 0.35)
  Top 0.152: v61.57,2.63 60.97,3.24 59.75,3.24 U$1.28 | v28.96,6.44 30.03,7.51 30.03,8.12 IC4.7 | v38.87,29.61 38.87,34.33 39.17,34.64 39.63,34.64 IC1.11 | v77.12,31.59 77.12,34.48 74.38,37.23 73.92,37.23 74HC4050D.4
  Bottom 0.152: v38.87,29.61 38.87,28.08 28.96,18.18 v28.96,6.44 28.96,4.31 31.25,2.02 60.97,2.02 v61.57,2.63 64.62,2.63 70.57,8.58 82,8.58 83.06,9.64 83.06,9.8 86.11,12.84 86.11,22.6 v77.12,31.59
N$26  (via drill 0.35)
  Top 0.152: v52.43,25.49 52.73,25.8 53.95,25.8 56.55,23.21 56.55,22.9 62.18,17.26 62.18,6.29 60.97,5.07 60.51,5.07 U$1.3 | v40.85,32.35 39.78,32.35 IC1.14
  Bottom 0.152: v52.43,25.49 50.14,25.49 47.25,28.39 44.81,28.39 v40.85,32.35
N$27
  Top 0.152: U$1.10 58.68,7.97 58.68,8.58 58.83,8.73 58.83,16.96 49.54,26.26 43.74,26.26 41.61,28.39 41.61,28.85 IC1.17
N$28
  Top 0.152: U$1.9 59.14,7.97 59.14,17.11 49.69,26.56 44.2,26.56 42.37,28.39 42.37,28.85 IC1.18
N$29
  Top 0.152: U$1.7 60.36,7.05 60.36,11.47 59.44,12.39 59.44,17.26 49.84,26.86 44.81,26.86 43.29,28.39 43.29,28.85 IC1.19
N$30  (via drill 0.35)
  Top 0.152: v70.87,37.38 69.96,37.38 IC3.5 | v74.38,19.24 64.32,19.24 v63.71,18.64 | v50.6,17.87 43.44,10.71 43.44,9.19 X2.2
  Bottom 0.152: v70.87,37.38 70.87,36.62 75.59,31.89 75.59,20.46 v74.38,19.24 | v63.71,18.64 62.79,18.64 61.12,16.96 51.52,16.96 v50.6,17.87
N$31  (via drill 0.35)
  Top 0.152: v67.37,29.46 69.04,31.13 74.99,31.13 75.44,31.59 75.44,34.79 74.83,35.4 72.85,35.4 71.48,36.77 69.96,36.77 IC3.4 | v51.67,18.79 51.67,18.03 44.2,10.56 44.2,9.19 X2.3
  Bottom 0.152: v67.37,29.46 56.7,18.79 v51.67,18.79
N$32  (via drill 0.35)
  Top 0.152: IC3.7 69.19,39.06 IC3.8 69.04,39.21 69.04,39.51 68.89,39.67 65.84,39.67 64.93,38.75 61.73,38.75 | 61.73,38.75 61.12,38.75 C9.1 | v51.36,20.92 42.68,12.23 42.68,9.19 X2.1 | 61.73,38.75 v61.73,36.47
  Bottom 0.152: v51.36,20.92 51.36,21.38 61.73,31.74 v61.73,36.47
N$33  (via drill 0.35)
  Top 0.152: X2.4 45.12,9.19 45.73,9.19 X2.5 45.88,9.19 45.88,11.78 52.28,18.18 v52.28,20.01 | 69.35,36.01 69.35,35.1 69.65,34.79 IC3.M 69.65,34.64 v69.65,33.72 | 69.35,36.01 69.65,36.31 69.8,36.31 IC3.3 | v64.93,31.89 61.12,31.89 C8.1 | 69.35,36.01 68.59,36.77 67.67,36.77 IC3.EXP
  Bottom 0.152: v69.65,33.72 67.82,31.89 v64.93,31.89 62.49,31.89 52.28,21.68 v52.28,20.01
N$34
  Top 0.152: IC2.13 77.27,14.22 77.27,11.93 79.1,10.1 DB9.3
N$35
  Top 0.152: IC2.14 79.86,14.22 79.86,12.08 81.84,10.1 DB9.2
N$36
  Top 0.152: C15.1 75.44,26.26 75.44,22.75 74.68,21.99 IC2.5
N$37
  Top 0.152: C15.2 76.81,26.26 76.81,22.29 77.12,21.99 IC2.4
N$38
  Top 0.152: C11.2 62.95,21.53 65.38,21.53 67.06,19.86 80.17,19.86 82.15,21.84 IC2.2
N$39
  Top 0.152: C10.1 81.08,25.65 81.08,23.21 79.86,21.99 IC2.3
N$40
  Top 0.152: C16.2 72.09,25.95 72.09,21.99 IC2.6
N$41
  Top 0.152: C10.2 82.45,25.65 82.45,24.27 84.74,21.99 IC2.1
N$42
  Top 0.152: SDCARD.2 67.82,50.18 67.82,44.24 72.85,39.21 77.58,39.21 78.19,38.6 79.41,38.6 74HC4050D.14
N$43  (via drill 0.35)
  Top 0.152: v41,54.6 49.38,46.22 49.38,44.54 IC1.54
  Bottom 0.152: v41,54.6 41.46,54.6 42.07,55.21 61.42,55.21 64.93,58.72 86.42,58.72 88.4,60.7 91.29,60.7 91.75,60.24 91.75,53.84 90.23,52.32 SV2.29
N$44
  Top 0.152: SDCARD.5 75.44,50.18 75.44,46.98 80.78,41.65 80.78,33.11 79.86,32.2 79.56,32.2 74HC4050D.9
N$45
  Top 0.152: SDCARD.1 65.23,50.18 65.23,45.61 72.85,37.99 75.9,37.99 79.1,34.79 79.41,34.79 74HC4050D.11
N$47  (via drill 0.35)
  Top 0.152: v48.77,45.61 48.77,44.54 IC1.55 | v58.22,53.99 58.22,55.67 v59.29,56.74
  Bottom 0.152: v48.77,45.61 49.69,45.61 58.07,53.99 v58.22,53.99 | v59.29,56.74 61.12,56.74 70.26,65.88 91.75,65.88 105.31,52.32 SV2.30
N$48
  Top 0.152: R5.1 27.59,15.28 21.65,15.28 10.37,4 LED1.A
N$49  (via drill 0.35)
  Top 0.152: v53.04,37.99 55.17,37.99 IC1.42
  Bottom 0.152: v53.04,37.99 51.97,37.99 37.04,52.93 29.72,52.93 29.42,52.62 29.42,50.34 18.6,39.51 SV1.20
N$50  (via drill 0.35)
  Top 0.152: v39.17,54.6 39.78,53.99 40.09,53.99 46.18,47.9 46.18,44.54 IC1.58
  Bottom 0.152: v39.17,54.6 40.39,55.82 61.12,55.82 64.62,59.33 85.5,59.33 88.55,62.37 88.55,62.68 89.16,63.29 91.14,63.29 92.36,62.07 92.36,49.27 90.23,47.13 SV2.25
N$51  (via drill 0.35)
  Top 0.152: v47.1,47.13 47.1,44.54 IC1.57 | v53.95,57.04 v53.95,53.99 | v85.2,59.94 v62.49,59.94 | v86.42,61.16 91.29,61.16 105.31,47.13 SV2.26
  Bottom 0.152: v53.95,53.99 v47.1,47.13 | v53.95,57.04 54.72,57.8 60.36,57.8 v62.49,59.94 | v86.42,61.16 v85.2,59.94
N$52
  Top 0.152: IC1.1 39.63,42.72 36.12,42.72 33.99,44.85 20.73,44.85 18.6,46.98 SV1.26
N$53
  Top 0.152: IC1.4 39.63,40.28 36.73,40.28 36.12,40.89 28.2,40.89 25.91,43.17 7.17,43.17 3.36,46.98 SV1.25
N$54  (via drill 0.35)
  Top 0.152: v40.85,42.26 40.85,40.12 40.24,39.51 39.78,39.51 IC1.5 | v25.46,45.46 22.56,45.46 18.6,49.42 SV1.28
  Bottom 0.152: v40.85,42.26 28.66,42.26 v25.46,45.46
N$55  (via drill 0.35)
  Top 0.152: v45.88,38.6 45.27,37.99 39.78,37.99 IC1.7 | v65.84,47.9 65.84,49.27 67.21,50.64 67.21,51.1 68.89,52.77 79.41,52.77 81.39,50.79 81.39,48.81 v82.76,47.44
  Bottom 0.152: v45.88,38.6 49.23,38.6 50.91,36.92 54.87,36.92 v65.84,47.9 | v82.76,47.44 82.76,41.8 90.07,34.48 SV2.15
N$56  (via drill 0.35)
  Top 0.152: v52.13,26.71 51.67,27.17 49.23,27.17 48.01,28.39 48.01,28.85 IC1.25 | v69.04,26.86 74.83,26.86 74.99,27.02 87.94,27.02 89.16,25.8 104.4,25.8 105.31,26.71 SV2.10
  Bottom 0.152: v52.13,26.71 53.04,25.8 53.04,23.51 50.75,21.23 50.75,18.79 51.52,18.03 56.85,18.03 65.69,26.86 v69.04,26.86
N$57
  Top 0.152: IC1.26 48.77,29 48.77,38.6 53.19,43.02 54.41,43.02 57.76,46.37 60.51,46.37 64.32,50.18 64.32,51.71 66.6,53.99 80.62,53.99 83.37,51.25 83.67,51.25 83.98,50.94 83.98,35.55 90.07,29.46 SV2.11
N$58  (via drill 0.35)
  Top 0.152: v51.06,30.22 51.06,29 IC1.29 | v68.59,45.61 69.04,46.07 69.04,50.34 70.26,51.55 78.03,51.55 79.86,49.73 79.86,49.42 v83.37,45.91 | v86.72,45.91 89.62,43.02 99.83,43.02 104.7,38.14 106.69,38.14 107.29,37.53 107.29,31.29 105.47,29.46 SV2.12
  Bottom 0.152: v51.06,30.22 51.82,30.22 52.58,30.98 53.95,30.98 v68.59,45.61 | v86.72,45.91 v83.37,45.91
N$59  (via drill 0.35)
  Top 0.152: v50.91,33.88 50.91,32.96 51.67,32.2 51.67,29 IC1.30 | v52.13,35.1 52.13,36.92 v51.52,37.53 | v53.65,47.74 53.65,53.38 53.35,53.69 53.35,57.35 v54.11,58.11 | v59.59,58.41 82,58.41 v84.74,55.67
  Bottom 0.152: v52.13,35.1 v50.91,33.88 | v51.52,37.53 52.58,37.53 52.73,37.38 53.35,37.38 53.65,37.69 v53.65,47.74 | v54.11,58.11 59.29,58.11 v59.59,58.41 | v84.74,55.67 84.74,54.75 85.5,53.99 85.5,52.62 84.43,51.55 82.45,51.55 81.84,52.16 81.23,52.16 80.93,51.86 80.93,43.17 88.55,35.55 88.55,33.42 90.07,31.89 SV2.13
N$60  (via drill 0.35)
  Top 0.152: v52.73,30.22 52.73,29 IC1.31 | v74.99,29.91 86.57,29.91 88.7,27.78 97.24,27.78 101.2,31.74 105.31,31.74 SV2.14
  Bottom 0.152: v52.73,30.22 53.8,30.22 60.66,37.08 69.96,37.08 74.99,32.05 v74.99,29.91
N$61  (via drill 0.35)
  Top 0.152: v52.73,32.5 55.17,32.5 IC1.35 | v24.24,32.35 v26.98,32.35
  Bottom 0.152: v52.73,32.5 47.25,32.5 41.92,37.84 32.47,37.84 v26.98,32.35 | v24.24,32.35 18.6,26.71 SV1.10
N$62  (via drill 0.35)
  Top 0.152: v53.8,34.64 54.56,35.4 55.17,35.4 IC1.39 | v26.98,27.78 26.52,27.32 23.02,27.32 18.6,31.74 SV1.14
  Bottom 0.152: v53.8,34.64 53.8,32.66 53.04,31.89 47.4,31.89 41.76,37.53 36.73,37.53 v26.98,27.78
N$63  (via drill 0.35)
  Top 0.152: v52.13,33.27 55.17,33.27 IC1.36 | v24.69,35.4 v26.98,35.4
  Bottom 0.152: v52.13,33.27 49.84,33.27 43.44,39.67 31.09,39.67 26.98,35.55 v26.98,35.4 | v24.69,35.4 18.6,29.3 SV1.12
N$64  (via drill 0.35)
  Top 0.152: v51.97,38.91 51.97,38.14 53.35,36.77 53.35,35.4 53.19,35.25 53.19,34.33 53.5,34.03 55.17,34.03 IC1.37
  Bottom 0.152: v51.97,38.91 51.52,38.91 37.04,53.38 29.57,53.38 29.11,52.93 29.11,50.49 19.05,40.43 11.43,40.43 3.82,32.81 2.29,32.81 1.68,32.2 1.68,30.83 3.21,29.3 SV1.11
N$65  (via drill 0.35)
  Top 0.152: v56.39,36.47 55.33,36.47 IC1.40
  Bottom 0.152: v56.39,36.47 54.26,36.47 54.11,36.62 46.94,36.62 41.92,41.65 28.5,41.65 25.46,44.7 24.24,44.7 20.12,40.58 20.12,39.06 18.9,37.84 9.3,37.84 3.36,31.89 SV1.13
N$66
  Top 0.152: IC1.9 39.63,36.31 37.65,36.31 35.36,34.03 32.01,34.03 30.03,36.01 19.36,36.01 18.6,36.77 SV1.18
N$67  (via drill 0.35)
  Top 0.152: v24.54,44.09 24.85,44.39 33.99,44.39 36.43,41.95 39.63,41.95 IC1.2 | v25.15,22.9 25.46,22.9 32.01,16.35 32.01,8.73 31.55,8.27 IC4.6
  Bottom 0.152: v24.54,44.09 24.54,38.3 19.05,32.81 17.53,32.81 16.92,32.2 16.92,26.41 18.14,25.19 22.86,25.19 v25.15,22.9
N$68  (via drill 0.35)
  Top 0.152: v36.89,41.04 39.63,41.04 IC1.3 | v26.98,24.73 27.28,24.73 32.62,19.4 32.62,8.27 IC4.5
  Bottom 0.152: v36.89,41.04 31.7,41.04 26.37,35.7 26.37,25.34 v26.98,24.73
STEPPER  (via drill 0.35)
  Top 0.152: v53.65,31.59 55.17,31.59 IC1.34 | v27.59,23.51 21.19,23.51 18.9,25.8 4.12,25.8 3.36,26.56 SV1.9
  Bottom 0.152: v53.65,31.59 47.1,31.59 43.9,34.79 42.37,34.79 38.26,30.68 38.26,29.3 38.56,29 38.56,28.39 35.21,25.04 29.11,25.04 v27.59,23.51
ULTRA  (via drill 0.35)
  Top 0.152: v48.47,43.32 48.47,40.28 45.42,37.23 39.78,37.23 IC1.8 | v57,49.12 57,48.2 57.92,47.29 v60.05,47.29 | v76.51,40.28 v69.8,46.98 | v85.35,37.84 106.53,37.84 106.99,37.38 106.99,36.01 105.47,34.48 SV2.16
  Bottom 0.152: v48.47,43.32 48.47,43.93 53.65,49.12 v57,49.12 | v60.05,47.29 64.32,47.29 65.54,48.51 68.28,48.51 v69.8,46.98 | v76.51,40.28 82.91,40.28 v85.35,37.84